# Altium project Naxida_Eyes_Down.PrjPcb
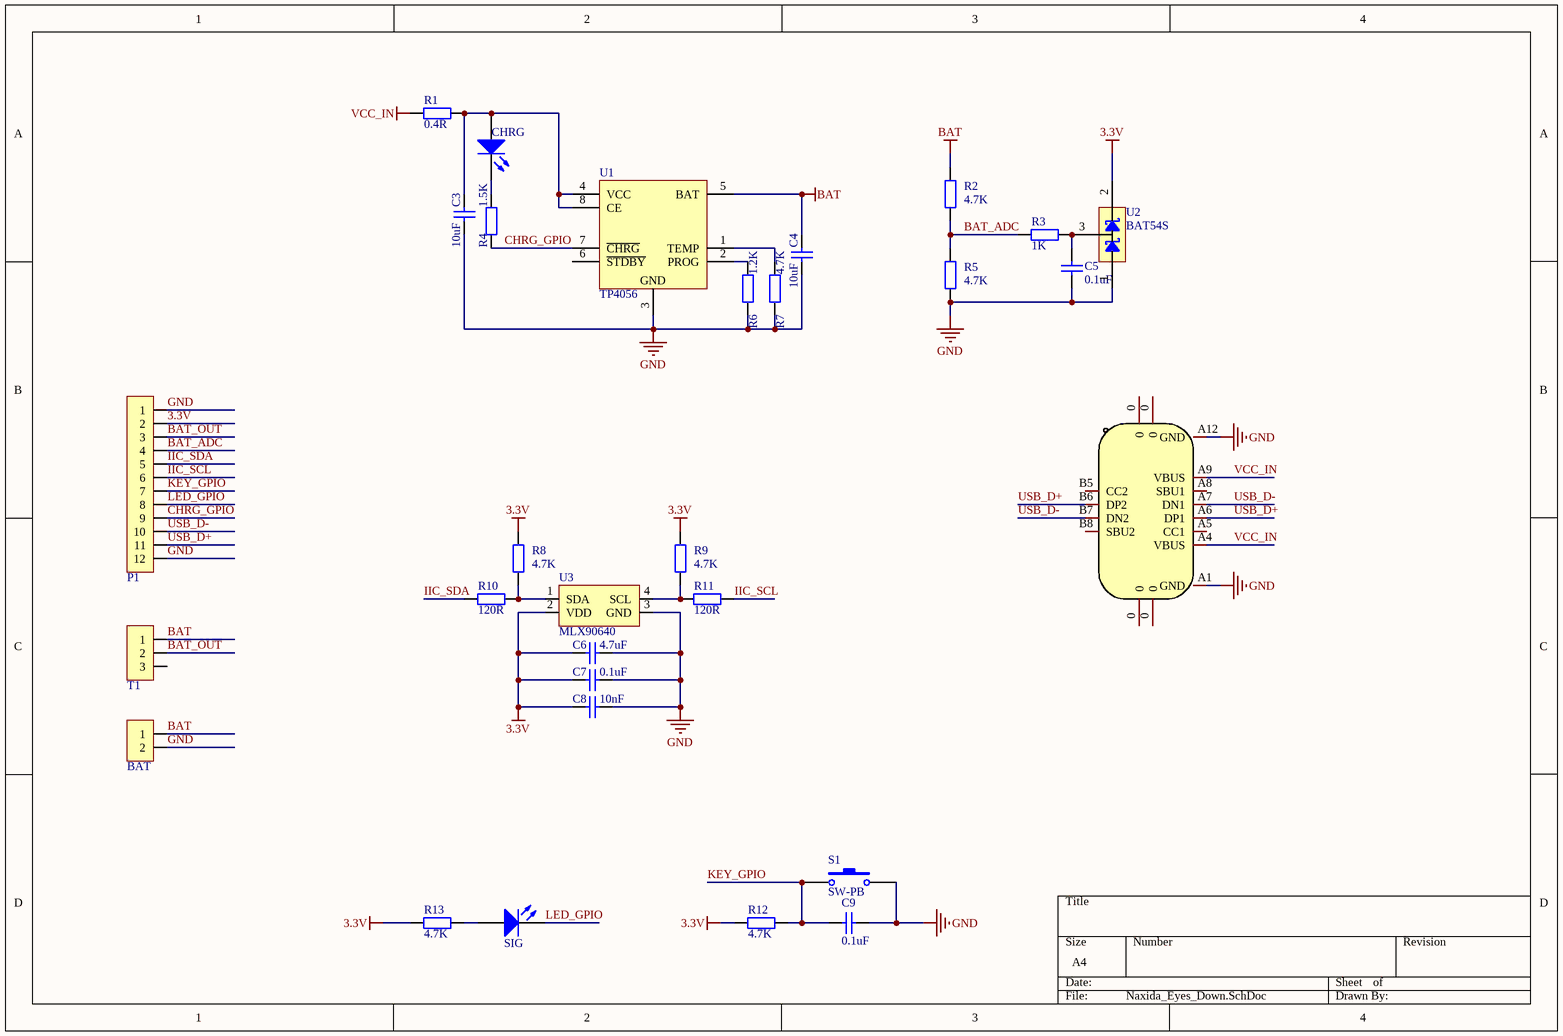
[diagram p0: Naxida_Eyes_Down.SchDoc]
1 sheet, 30 parts. Net scope: global (net labels, ports and power ports of the same name join across sheets).
Board file: Naxida_Eyes_Down.PcbDoc

## Sheet Naxida_Eyes_Down.SchDoc
size A4

### Parts
BAT  Header 2*1  [COM_T_2.0_2P]  (value not drawn)
C3  10uF  [LC-1206_C]
C4  10uF  [LC-1206_C]
C5  0.1uF  [LC-0603_C]
C6  4.7uF  [LC-0603_C]
C7  0.1uF  [LC-0603_C]
C8  10nF  [LC-0603_C]
C9  value 0.1uF  [LC-0603_C]  (hidden comment: Cap)
CHRG  LED0  [LC-0603_LED_S1]  (value not drawn)
P1  Header 12*1  [HDR12X1_A-1.27mm]  (value not drawn)
R1  0.4R  [LC-1206_R]
R2  4.7K  [LC-0603_R]
R3  1K  [LC-0603_R]
R4  1.5K  [LC-0603_R]
R5  4.7K  [LC-0603_R]
R6  1.2K  [LC-0603_R]
R7  4.7K  [LC-0603_R]
R8  4.7K  [LC-0603_R]
R9  4.7K  [LC-0603_R]
R10  120R  [LC-0603_R]
R11  120R  [LC-0603_R]
R12  value 4.7K  [LC-0603_R]  (hidden comment: Res1)
R13  value 4.7K  [LC-0603_R]  (hidden comment: Res1)
S1  SW-PB  [KEY_3*6*3.5]
SIG  LED0  [LC-0603_LED_S1]  (value not drawn)
T1  Header 3*1  [KEY_3*7]  (value not drawn)
U1  TP4056  [ESOP_4056]
U2  BAT54S  [SOT-23]
U3  MLX90640  [MLX90640]
USBC1  TYPE-C  [TYPE-C-16P]  (value not drawn)

### Nets
3.3V: C6.2 C7.2 C8.2 P1.2 R8.1 R9.1 R12.1 R13.1 U2.2 U3.2(VDD)
BAT: BAT.1 C4.2 R2.1 T1.1 U1.5(BAT)
GND: BAT.2 C3.1 C4.1 C5.1 C6.1 C7.1 C8.1 C9.2 P1.1 P1.12 R5.2 R6.2 R7.2 S1.2 U1.3(GND) U2.1 U3.3(GND) USBC1.A1(GND) USBC1.A12(GND)
VCC_IN: R1.2 USBC1.A4(VBUS) USBC1.A9(VBUS)
BAT_ADC: P1.4 R2.2 R3.1 R5.1
BAT_OUT: P1.3 T1.2
CHRG_GPIO: P1.9 R4.2 U1.7(~{CHRG})
IIC_SCL: P1.6 R11.2
IIC_SDA: P1.5 R10.1
KEY_GPIO: C9.1 P1.7 R12.2 S1.1
LED_GPIO: P1.8 SIG.2(K)
USB_D+: P1.11 USBC1.A6(DP1) USBC1.B6(DP2)
USB_D-: P1.10 USBC1.A7(DN1) USBC1.B7(DN2)
NetC3_2: C3.2 CHRG.1(A) R1.1 U1.4(VCC) U1.8(CE)
NetC5_2: C5.2 R3.2 U2.3
NetCHRG_2: CHRG.2(K) R4.1
NetR6_1: R6.1 U1.2(PROG)
NetR7_1: R7.1 U1.1(TEMP)
NetR8_2: R8.2 R10.2 U3.1(SDA)
NetR9_2: R9.2 R11.1 U3.4(SCL)
NetR13_2: R13.2 SIG.1(A)

Not connected (* = marked no-connect by the designer): T1 3; U1 6(~{STDBY}); USBC1 0 A5(CC1) A8(SBU1) B5(CC2) B8(SBU2)

### Library data of the parts
BAT = Header 2*1: 接插件; LatestRevisionDate: 17-Jul-2002; LatestRevisionNote: Re-released for DXP Platform.; Publisher: Altium Limited
C3-C9 = Cap: 无极性电容; Published: 8-Jun-2000; LatestRevisionDate: 17-Jul-2002; LatestRevisionNote: Re-released for DXP Platform.; PackageReference: RAD-0.3; Publisher: Altium Limited
  C3 C4: Value: 10uF
  C5 C7: Value: 0.1uF
  C6: Value: 4.7uF
  C8: Value: 10nF
CHRG SIG = LED0: 发光二极管; Published: 8-Jun-2000; LatestRevisionDate: 08-Jul-2005; LatestRevisionNote: Mech Layer 1 removed.; PackageReference: LED-0; Publisher: Altium Limited
P1 = Header 12*1: 接插件; LatestRevisionDate: 17-Jul-2002; LatestRevisionNote: Re-released for DXP Platform.; Publisher: Altium Limited
R1-R13 = Res1: 贴片电阻; Published: 8-Jun-2000; LatestRevisionDate: 17-Jul-2002; LatestRevisionNote: Re-released for DXP Platform.; PackageReference: AXIAL-0.4; Publisher: Altium Limited
  R1: Value: 0.4R
  R2 R5 R7-R9: Value: 4.7K
  R3: Value: 1K
  R4: Value: 1.5K
  R6: Value: 1.2K
  R10 R11: Value: 120R
S1 = SW-PB: 微动开关; pin to pad: 1>2 2>1; Published: 24-Mar-1999; LatestRevisionDate: 17-Jul-2002; LatestRevisionNote: Re-released for DXP Platform.; PackageReference: SPST-2; Publisher: Altium Limited
T1 = Header 3*1: 接插件; LatestRevisionDate: 17-Jul-2002; LatestRevisionNote: Re-released for DXP Platform.; Publisher: Altium Limited
U1 = TP4056: 锂电池充电管理
U2 = BAT54S: 肖特基二极管
USBC1 = TYPE-C: Manufacturer: 精拓金; Name: 918-418K2023S40001; Symbol: USB3.1C16PFSMT; Add into BOM: yes; Gender: 母座; Number of Contacts: 16; Number of Ports: 1; Current Rating - Power (Max): 3A; Device: 918-418K2023S40001; LCSC Part Name: Type-C 母座; Supplier Part: C167321; Manufacturer Part: 918-418K2023S40001; Supplier Footprint: SMD; JLCPCB Part Class: Extended Part; Datasheet: https://atta.szlcsc.com/upload/public/pdf/source/20210305/C167321_3BB79E85CEB6874BF587E64926D16F83.pdf; Supplier: LCSC; Convert to PCB: yes; Connector Type: Type-C; Standard: -